# EAGLE design UTN-ESINT01 (EAGLE 8.3.1)
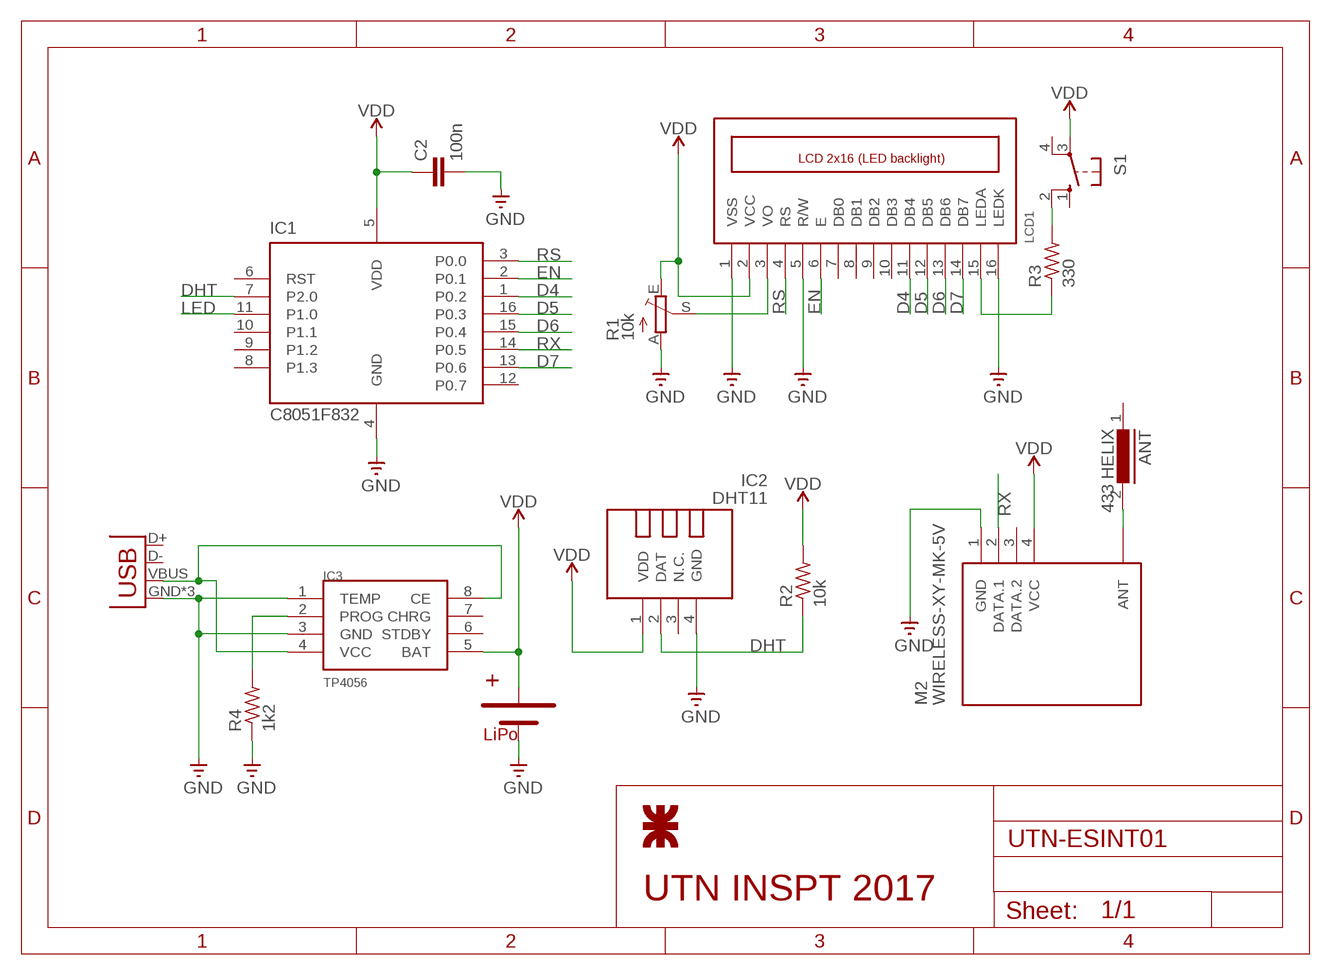
[diagram p0: schematic, sheet 1]

## Parts
ANT  433 HELIX  SMSC20  [SMSC20]
C2  100n  C-EU050-024X044  [C050-024X044]
IC1  C8051F832  [SOIC16R]
IC2  DHT11  TEMP-HUM-SENSOR-DHT11  [TEMP-HUM-SENSOR-DHT11]
IC3  TP4056  [SOP-8]
LCD1  LCD_2X16_SIL  [HY-1602F]
M2  WIRELESS-XY-MK-5V  [WIRELESS-XY-MK-5V]
R1  10k  TRIM_EU-B64Y  [B64Y]
R2  10k  R-US_0207/10  [0207/10]
R3  330  R-US_0207/10  [0207/10]
R4  1k2  R-US_0207/10  [0207/10]
S1  10-XX  [B3F-10XX]
U$3  UTN_LOGO  [UTN_LOGO]
U$4  LiPo  BATTERYPAD  [BATTERYPAD]
X1  USB-MICROB  [USB-MICROB]

## Nets
D4: IC1.1(P0.2) LCD1.11(DB4)
D5: IC1.16(P0.3) LCD1.12(DB5)
D6: IC1.15(P0.4) LCD1.13(DB6)
D7: IC1.13(P0.6) LCD1.14(DB7)
DHT: IC1.7(P2.0) IC2.2(DAT) R2.1
EN: IC1.2(P0.1) LCD1.6(E)
GND: C2.2 IC1.4(GND) IC2.4(GND) IC3.1(TEMP) IC3.3(GND) LCD1.1(VSS) LCD1.5(R/W) LCD1.16(LEDK) M2.1(GND) R1.A R4.1 U$4.-VE X1.GND X1.MT1(GND) X1.MT2(GND)
LED: IC1.11(P1.0)
N$1: ANT.2 M2.ANT
N$3: IC3.4(VCC) IC3.8(CE) X1.VBUS
N$4: LCD1.3(VO) R1.S
N$5: LCD1.15(LEDA) R3.1
N$6: R3.2 S1.2(S1)
N$8: IC3.2(PROG) R4.2
RS: IC1.3(P0.0) LCD1.4(RS)
RX: IC1.14(P0.5) M2.2(DATA.1)
VDD: C2.1 IC1.5(VDD) IC2.1(VDD) IC3.5(BAT) LCD1.2(VCC) M2.4(VCC) R1.E R2.2 S1.3(P) U$4.+VE
Unconnected: ANT.1 IC1.6(RST) IC1.8(P1.3) IC1.9(P1.2) IC1.10(P1.1) IC1.12(P0.7) IC2.3(N.C.) IC3.6(STDBY) IC3.7(CHRG) LCD1.7(DB0) LCD1.8(DB1) LCD1.9(DB2) LCD1.10(DB3) M2.3(DATA.2) S1.1(S) S1.4(P1) X1.D+ X1.D-

## Notes on the sheet
- LiPo
- UTN INSPT 2017

## Library data of the parts
ANT = inductors:SMSC20: INDUCTOR
C2 = rcl:C-EU: CAPACITOR, European symbol
IC1 = silabs-2:C8051F832: 8kB ILP Flash MCU Family Source: www.silabs.com .. C8051F33x.pdf
IC2 = diy-modules:TEMP-HUM-SENSOR-DHT11: DHT11 - digital humidity & temperature sensor DHT11 datasheet available here: https://akizukidenshi.com/download/ds/aosong/DHT11.pdf Click here to find device on ebay.com <http://www.ebay.com/sch/dht11+digital+sensor>
IC3 = TP4056:TP4056
LCD1 = lcd_2x16_led_backlight:LCD_2X16_SIL
M2 = diy-modules:WIRELESS-XY-MK-5V: RF Wireless XY-MK-5V Receiver Click here to find device on ebay.com <http://www.ebay.com/sch/xd+rf+5v-receiver> Note: Sold together with transmitter.
R1 = pot:TRIM_EU-: POTENTIOMETER
R2-R4 = rcl:R-US_: RESISTOR, American symbol
S1 = switch-omron:10-XX: OMRON SWITCH; MPN: B3F-1000; OC_FARNELL: 176432; OC_NEWARK: 36M3542
U$3 = UTN_LOGO:UTN_LOGO
U$4 = computronics.com.au:BATTERYPAD: Battery Pads to add external battery
X1 = SparkFun-Connectors:USB: USB Connectors USB-B-PTH is fully proven SKU : PRT-00139/CONN-08278 USB-miniB is fully proven SKU : PRT-00587 USB-A-PCB is untested. USB-A-H is throughly reviewed, but untested. Spark Fun Electronics SKU : PRT-00437 USB-B-SMT is throughly reviewed, but untested. Needs silkscreen touching up. USB-A-S has not been used/tested USB-MB-H has not been used/tested USB-MICROB has been used. CONN-09505; PROD_ID: CONN-09505

## Board
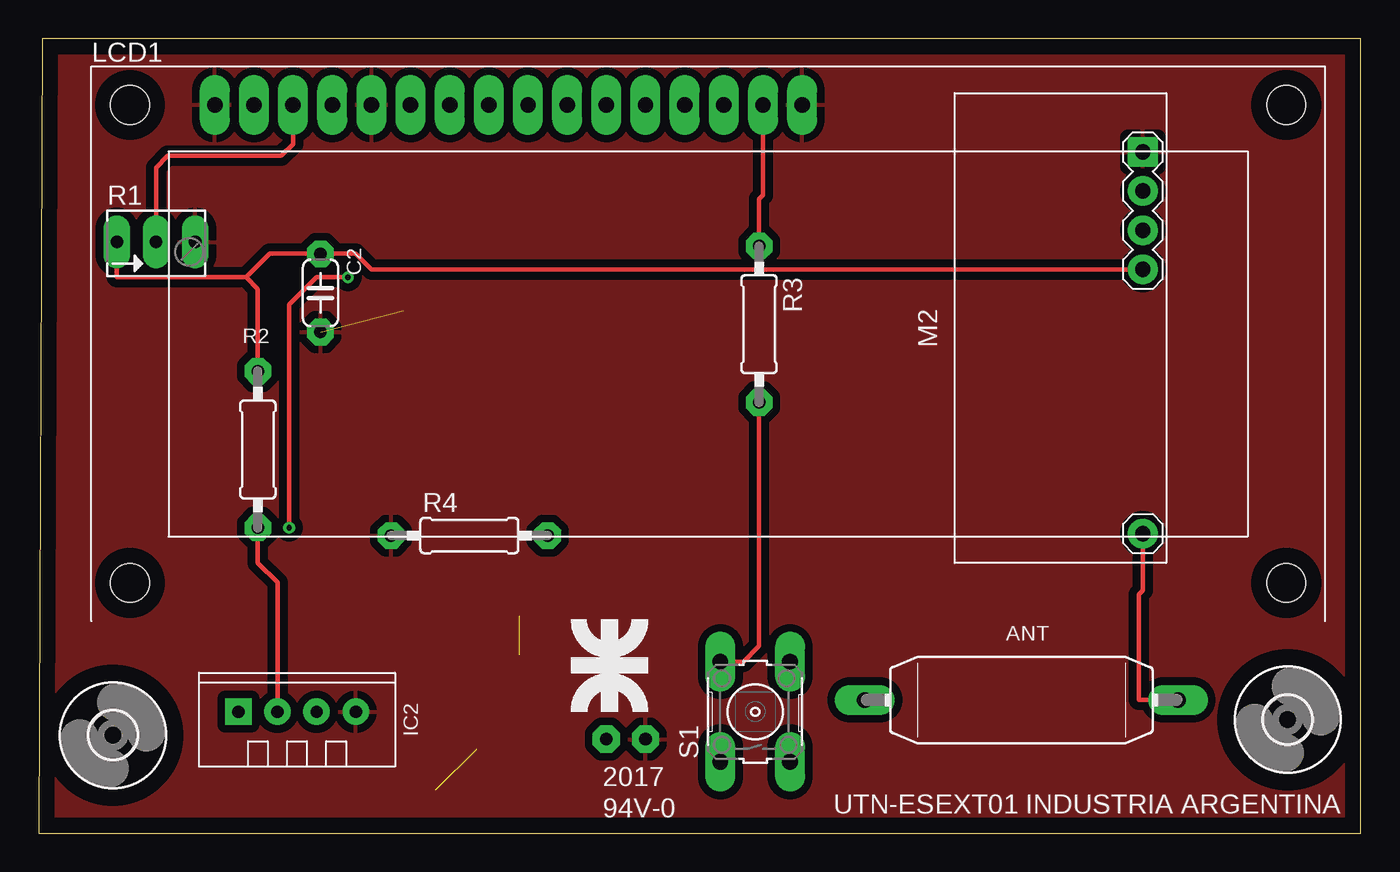
[diagram p1: board, top side]
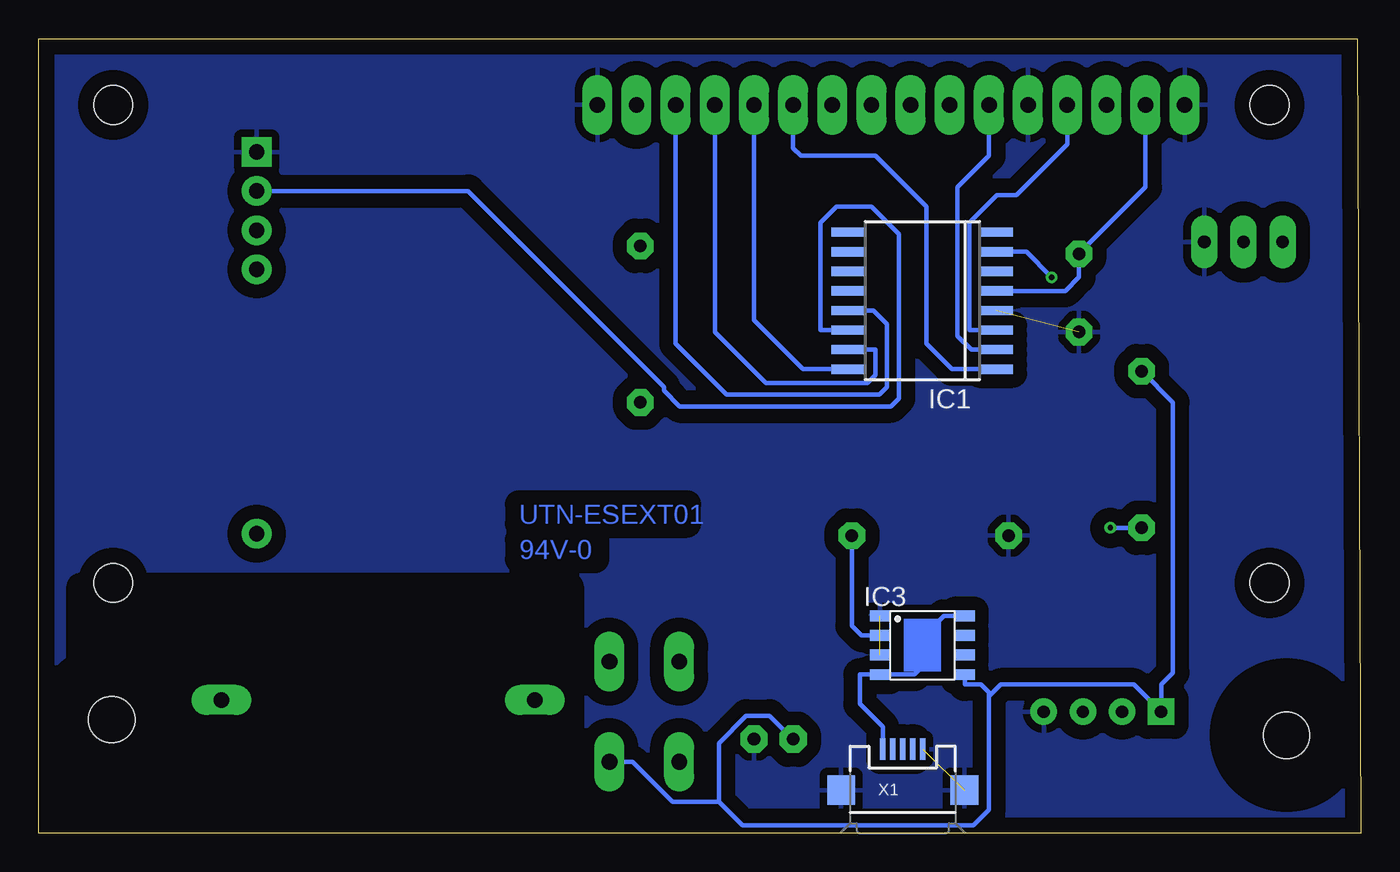
[diagram p2: board, bottom side, seen from below]

Size 85.78 x 51.55 mm. Coordinates in mm from the lower left corner, seen from the top.
Outline: 0,0 85.78,0 85.78,51.55 0.25,51.55 0,0
Copper layers (1*16): Top 0.035mm / dielectric 1.5mm / Bottom 0.035mm
Design rules "default *": minimum track width 6mil, minimum drill 0.35mm, track to track 6mil, track to pad 6mil, pad to pad 6mil, via to via 6mil, smd to smd 6mil, copper to edge 40mil, drill to drill 6mil, minimum pad ring 18mil, minimum via ring 8mil, stop-mask expansion 4mil, vias tented up to drill 0mil, thermal gap 20mil
bRestrict: area 51.3,0.8 to 83.1,16

### Footprints (pad centres in the part's own frame; a part is rotated, then mirrored left to right if it is on the bottom)
SMSC20 = drill 1.016 long: 1 -10.16,0; 2 10.16,0
C050-024X044 = drill 0.813 octagon: 1 -2.54,0; 2 2.54,0
SOIC16R = smd 0.6 x 2.2: 1 -4.445,-4.775; 2 -3.175,-4.775; 3 -1.905,-4.775; 4 -0.635,-4.775; 5 0.635,-4.775; 6 1.905,-4.775; 7 3.175,-4.775; 8 4.445,-4.775; 9 4.445,4.8; 10 3.175,4.8; 11 1.905,4.8; 12 0.635,4.8; 13 -0.635,4.8; 14 -1.905,4.8; 15 -3.175,4.8; 16 -4.445,4.8
TEMP-HUM-SENSOR-DHT11 = drill 0.8 square: 1 -3.81,0 | drill 0.8: 2 -1.27,0; 3 1.27,0; 4 3.81,0
SOP-8 = smd 1.3 x 0.7: 1 -2.75,1.905; 2 -2.75,0.635; 3 -2.75,-0.635; 4 -2.75,-1.905; 5 2.75,-1.905; 6 2.75,-0.635; 7 2.75,0.635; 8 2.75,1.905
HY-1602F = drill 1 pad 1.93 long: 1 2.54,0; 2 5.08,0; 3 7.62,0; 4 10.16,0; 5 12.7,0; 6 15.24,0; 7 17.78,0; 8 20.32,0; 9 22.86,0; 10 25.4,0; 11 27.94,0; 12 30.48,0; 13 33.02,0; 14 35.56,0; 15 38.1,0; 16 40.64,0 | hole 2.5: -2.96,0; 72.04,0; -2.96,-31; 72.04,-31
WIRELESS-XY-MK-5V = drill 1 square: 1 11.43,-5.08 | drill 1: 2 8.89,-5.08; 3 6.35,-5.08; 4 3.81,-5.08; ANT -13.335,-5.08
B64Y = drill 0.813 long: A 2.54,0; E -2.54,0; S 0,0
0207/10 = drill 0.813 octagon: 1 -5.08,0; 2 5.08,0
B3F-10XX = drill 1.016 long: 1 -3.251,2.261; 2 3.251,2.261; 3 -3.251,-2.261; 4 3.251,-2.261
3,0 = hole 3: 0,0
BATTERYPAD = drill 0.813 pad 1.778 octagon: +VE -1.27,0; -VE 1.27,0
USB-MICROB = smd 0.35 x 1.4: D+ 0,2.65; D- -0.65,2.65; GND 1.3,2.65; ID 0.65,2.65; VBUS -1.3,2.65 | smd 1.8 x 1.9: MT1 -4,0; MT2 4,0

### Placement (x,y rotation side)
ANT  63.75,8.64 0 top
C2  18.29,35.05 270 top
IC1  28.45,34.54 90 bottom
IC2  16.76,7.87 0 top
IC3  28.45,12.19 0 bottom
LCD1  8.89,47.24 0 top
M2  66.55,32.77 90 top
R1  7.62,38.35 0 top
R2  14.22,24.89 90 top
R3  46.74,33.02 270 top
R4  27.94,19.3 0 top
S1  46.48,7.87 90 top
U$1  [3,0]  81.03,7.37 0 top
U$2  [3,0]  4.83,6.35 0 top
U$3  34.54,7.87 0 top
U$4  38.1,6.1 0 top
X1  29.72,2.79 0 bottom

### Tracks (layer width: path | path; a pad name or v marks a point on that pad's centre or on a via)
D4
  Bottom 0.305: LCD1.11 36.83,44.45 36.32,43.94 31.5,43.94 28.19,40.64 28.19,31.75 26.54,30.1 IC1.1
D5
  Bottom 0.305: LCD1.12 39.37,33.27 36.2,30.1 IC1.16
D6
  Bottom 0.305: LCD1.13 41.91,32.51 38.61,29.21 32,29.21 31.5,29.72 31.5,31.37 IC1.15
D7
  Bottom 0.305: LCD1.14 44.45,31.75 41.15,28.45 31.24,28.45 30.73,28.96 30.73,33.02 31.62,33.91 IC1.13
DHT  (via drill 0.35 pad 0.76)
  Top 0.305: R2.1 14.22,17.53 15.49,16.26 IC2.2 | v16.26,19.81 16.26,34.29 18.03,36.07 v20.07,36.07
  Bottom 0.305: v20.07,36.07 21.72,37.72 IC1.7 | R2.1 v16.26,19.81
EN
  Bottom 0.305: LCD1.6 24.13,43.94 26.16,41.91 26.16,32.26 25.27,31.37 IC1.2
GND  (3 unrouted)
  pour Bottom (isolate 0.914): 0,51.56 0,-0.25 85.85,-0.25 85.85,51.56
  pour Top (isolate 0.508): 0.25,51.31 0.25,0 85.6,0 85.6,51.31
N$1
  Top 0.305: M2.ANT 71.63,15.75 71.37,15.49 71.37,8.64 ANT.2
N$3
  Bottom 0.305: X1.VBUS 31.02,6.89 32.51,8.38 32.51,10.29 IC3.4 28.96,10.29 27.94,11.3 27.94,13.21 27.05,14.1 IC3.8
N$4
  Top 0.305: LCD1.3 16.51,44.7 15.75,43.94 8.38,43.94 7.62,43.18 R1.S
N$5
  Top 0.305: R3.1 46.74,41.15 46.99,41.4 LCD1.15
N$6
  Top 0.305: S1.2 45.72,11.12 46.74,12.14 R3.2
N$8
  Bottom 0.305: R4.2 33.02,13.46 32.38,12.83 IC3.2
RS
  Bottom 0.305: LCD1.4 19.05,44.7 22.35,41.4 23.62,41.4 25.4,39.62 25.4,32.64 IC1.3
RX
  Bottom 0.305: M2.2 57.91,41.66 45.21,28.96 45.21,28.7 44.2,27.69 30.48,27.69 29.97,28.19 29.97,38.86 31.75,40.64 34.04,40.64 35.05,39.62 35.05,32.64 IC1.14
VDD
  Top 0.305: M2.4 21.59,36.58 20.57,37.59 C2.1 14.99,37.59 13.46,36.07 | 13.46,36.07 5.08,36.07 R1.E | R2.2 14.22,35.31 13.46,36.07
  Bottom 0.305: R2.2 12.19,27.94 12.19,10.41 12.95,9.65 IC2.1 14.73,9.65 23.37,9.65 24.13,8.89 | 41.66,2.03 44.65,2.03 47.24,4.62 S1.3 | 41.66,2.03 41.66,5.84 39.88,7.62 38.35,7.62 U$4.+VE | 24.13,8.89 24.13,1.52 25.15,0.51 40.13,0.51 41.66,2.03 | LCD1.2 13.97,41.91 C2.1 18.29,36.07 19.18,35.18 IC1.5 | 24.13,8.89 24.13,9.14 24.64,9.65 25.7,9.65 IC3.5

### Text on the board
Bottom: UTN-ESEXT01 | 94V-0
tNames: 2017 | 94V-0 | UTN-ESEXT01 | INDUSTRIA ARGENTINA